# Altium schematic sheet 22_Nvidia_CAN.SchDoc
size A4; SheetNumber: 23; SheetTotal: 24
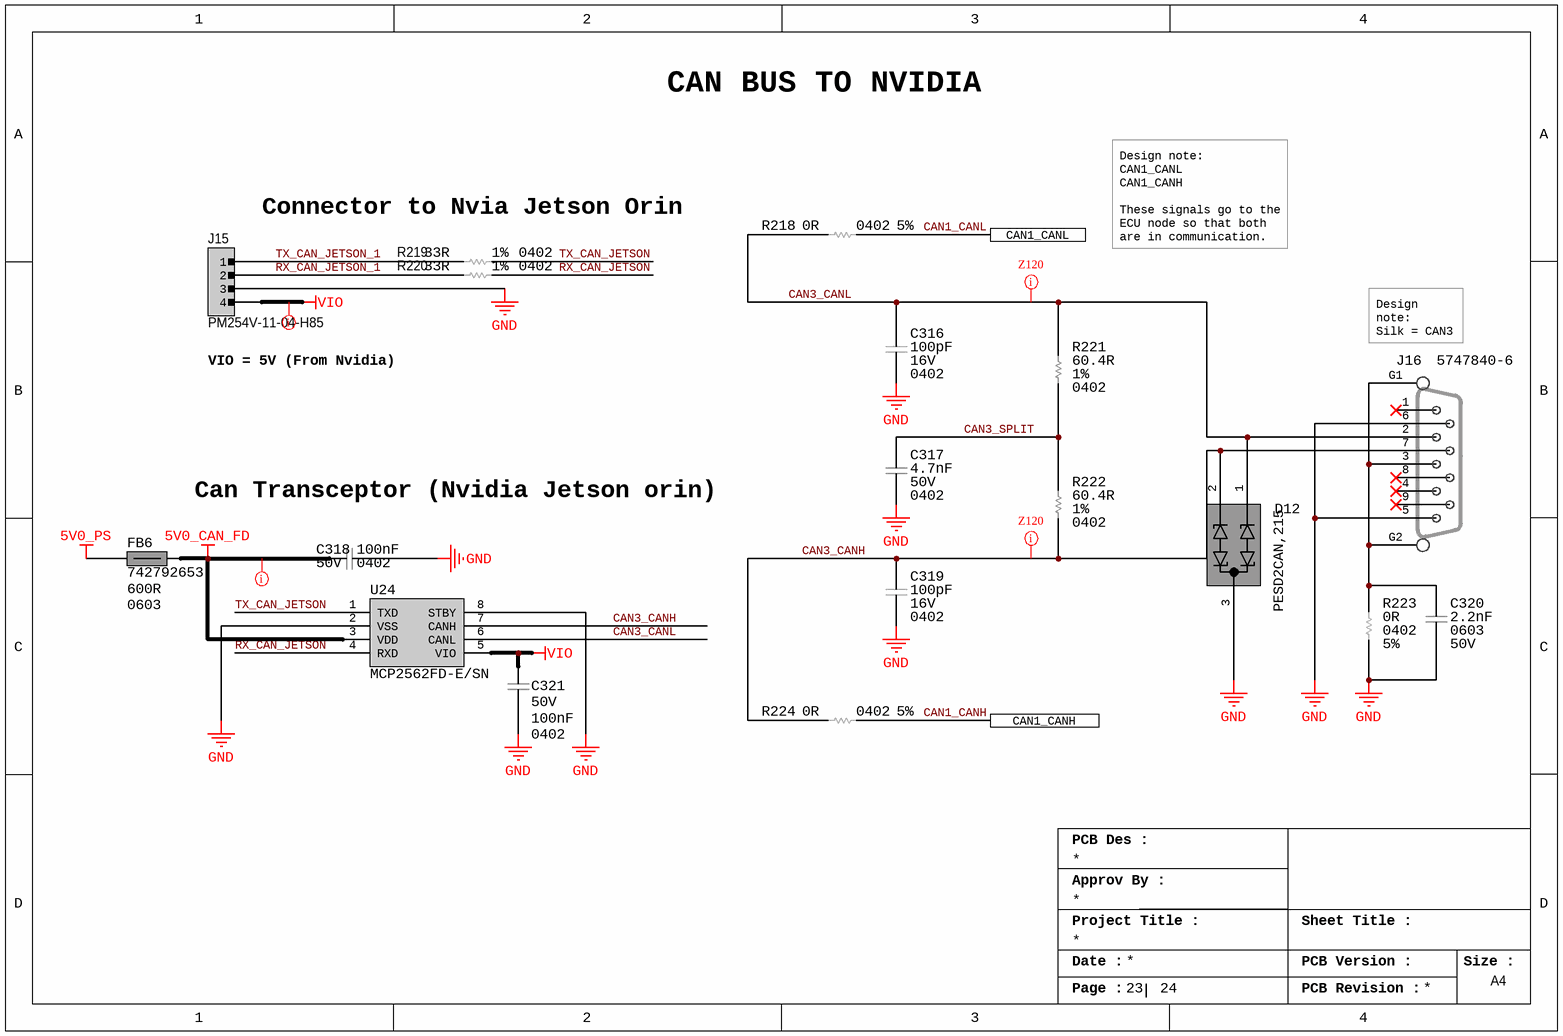
[diagram p0: 22_Nvidia_CAN.SchDoc]

## Parts
C316  Voltage Rating (DC): 16V  Capacitance: 100pF  Case/Package: 0402  [CAP_0402_CAPC1005X05N]  (hidden comment: CC0402JRNPO7BN101)
C317  Voltage Rating: 50V  Capacitance: 4.7nF  Case/Package: 0402  [CAP_0402_CAPC1005X05N]  (hidden comment: GRM155R61H472KA01D)
C318  Voltage Rating: 50V  Capacitance: 100nF  Case/Package: 0402  [CAP_0402_CAPC1005X05N]  (hidden comment: GRM155R71H104KE14D)
C319  Voltage Rating (DC): 16V  Capacitance: 100pF  Case/Package: 0402  [CAP_0402_CAPC1005X05N]  (hidden comment: CC0402JRNPO7BN101)
C320  Case/Package: 0603  Voltage Rating: 50V  Capacitance: 2.2nF  [CAP_0603_CAPC1608X08N]  (hidden comment: GRM1885C1H222JA01D)
C321  Voltage Rating: 50V  Capacitance: 100nF  Case/Package: 0402  [CAP_0402_CAPC1005X05N]  (hidden comment: GRM155R71H104KE14D)
D12  PESD2CAN,215  [DIO_PESD2CAN,215]
FB6  742792653  Impedance: 600R  Case Code (Imperial): 0603  [IND_0603_INDC1608X08N]
J15  PM254V-11-04-H85  [CONN_HEADER_FEM_4P]
J16  5747840-6  [TE_5747840-6]
R218  Case Code (Imperial): 0402  Tolerance: 5%  Resistance: 0R  [RES_0402_RESC1005X04N]  (hidden comment: ERJ-2GE0R00X)
R219  Tolerance: 1%  Resistance: 33R  Case/Package: 0402  [RES_0402_RESC1005X04N]  (hidden comment: RC0402FR-0733RL)
R220  Tolerance: 1%  Resistance: 33R  Case/Package: 0402  [RES_0402_RESC1005X04N]  (hidden comment: RC0402FR-0733RL)
R221  Tolerance: 1%  Resistance: 60.4R  Case/Package: 0402  [RES_0402_RESC1005X04N]  (hidden comment: RK73H1ETTP60R4F)
R222  Tolerance: 1%  Resistance: 60.4R  Case/Package: 0402  [RES_0402_RESC1005X04N]  (hidden comment: RK73H1ETTP60R4F)
R223  Case Code (Imperial): 0402  Tolerance: 5%  Resistance: 0R  [RES_0402_RESC1005X04N]  (hidden comment: ERJ-2GE0R00X)
R224  Case Code (Imperial): 0402  Tolerance: 5%  Resistance: 0R  [RES_0402_RESC1005X04N]  (hidden comment: ERJ-2GE0R00X)
U24  MCP2562FD-E/SN  [SOIC127P600X175-8N]

## Ports
CAN1_CANH, CAN1_CANL

## Nets
5V0_CAN_FD: C318.1 FB6.2 U24.3(VDD)
5V0_PS: FB6.1
GND: C316.1 C317.1 C318.2 C319.1 C320.1 C321.2 D12.3(CC) J15.3 J16.5 J16.6 R223.1 U24.2(VSS) U24.8(STBY)
VIO: C321.1 J15.4 U24.5(VIO)
CAN1_CANH: R224.2 ; port CAN1_CANH
CAN1_CANL: R218.2 ; port CAN1_CANL
CAN3_CANH: C319.2 D12.2(C2) J16.7 R222.1 R224.1 U24.7(CANH)
CAN3_CANL: C316.2 D12.1(C1) J16.2 R218.1 R221.2 U24.6(CANL)
CAN3_SPLIT: C317.2 R221.1 R222.2
RX_CAN_JETSON: R220.2 U24.4(RXD)
RX_CAN_JETSON_1: J15.2 R220.1
TX_CAN_JETSON: R219.2 U24.1(TXD)
TX_CAN_JETSON_1: J15.1 R219.1
NetC320_2: C320.2 J16.3 J16.G1 J16.G2(G) R223.2

Not connected (* = marked no-connect by the designer): J16 1* 4* 8* 9*

## Layout directives
net class PWR: 5V0_CAN_FD, VIO
net class Z120: CAN3_CANH, CAN3_CANL

## Notes on the sheet
- CAN BUS TO NVIDIA
- Connector to Nvia Jetson Orin
- Design note:
  CAN1_CANL
  CAN1_CANH
  These signals go to the ECU node so that both are in communication.
- (near J15) VIO = 5V (From Nvidia)
- (near J16) Design note:
  Silk = CAN3
- Can Transceptor (Nvidia Jetson orin)
- PCB Des :
- Approv By :
- Project Title :
- Sheet Title :
- Date :
- PCB Version :
- Size :
- A4
- Page :
- PCB Revision :

## Library data of the parts
C316 C319 = CAP_100PF_16V_NP0_0402: 0402 100 pF 16 V ±5 % Tolerance NP0 SMT Multilayer Ceramic Capacitor; Manufacturer: Yageo; Tolerance: 5%; Supplier 1: Digi-Key; Manufacturer Part Number: CC0402JRNPO7BN101; RoHS: Yes; Category: Ceramic Capacitors; Stock 1: 66004; Pricing 1: 1=0.1, 10=0.024, 50=0.013, 100=0.0107, 500=0.00764, 1000=0.006, 2500=0.00546, 5000=0.00502 (USD); Mount: Surface Mount; Number of Pins: 2; Case Code (Imperial): 0402; Case Code (Metric): 1005; Weight: 2.3E-05oz; Min Operating Temperature: -55°C; Max Operating Temperature: 125°C; Packaging: Tape and Reel; Voltage Rating: 16V; Dielectric: NP0; Termination: SMD/SMT; Series: CC; Length: 0.039inch; Width: 0.02inch; Thickness: 0.022inch; Lead Free: Lead Free; RoHS Compliant: Yes; ComponentLink1URL: http://www.mouser.com/ds/2/447/Yageo_UPY-GP_NP0_16V-to-50V_9-358835.pdf?src-supplier=Mouser; ComponentLink1Description: http://www.mouser.com/ds/2/447/Yageo_UPY-GP_NP0_16V-to-50V_9-358835.pdf?src-supplier=Mouser; ComponentLink2URL: https://datasheet.octopart.com/CC0402JRNPO7BN101-Yageo-datasheet-137700082.pdf?src-supplier=Future+Electronics; ComponentLink2Description: https://datasheet.octopart.com/CC0402JRNPO7BN101-Yageo-datasheet-137700082.pdf?src-supplier=Future+Electronics; ComponentLink3URL: http://www.yageo.com/documents/recent/UPY-GP_NP0_16V-to-50V_9.pdf?src-supplier=Future+Electronics; ComponentLink3Description: http://www.yageo.com/documents/recent/UPY-GP_NP0_16V-to-50V_9.pdf?src-supplier=Future+Electronics; ComponentLink4URL: http://www.yageo.com/exep/pages/download/literatures/ProductSelectionGuide%202014_Final_2.pdf?src-supplier=Digi-Key; ComponentLink4Description: http://www.yageo.com/exep/pages/download/literatures/ProductSelectionGuide%202014_Final_2.pdf?src-supplier=Digi-Key; ComponentLink5URL: https://www.yageo.com/upload/media/product/productsearch/datasheet/mlcc/UPY-GP_NP0_16V-to-50V_18.pdf?src-supplier=Digi-Key; ComponentLink5Description: https://www.yageo.com/upload/media/product/productsearch/datasheet/mlcc/UPY-GP_NP0_16V-to-50V_18.pdf?src-supplier=Digi-Key; ComponentLink6URL: http://www.yageo.com/documents/recent/UPY-GP_NP0_16V-to-50V_16.pdf?src-supplier=Digi-Key; ComponentLink6Description: http://www.yageo.com/documents/recent/UPY-GP_NP0_16V-to-50V_16.pdf?src-supplier=Digi-Key; ComponentLink7URL: https://datasheet.octopart.com/CC0402JRNPO7BN101-Yageo-datasheet-65873193.pdf?src-supplier=Farnell; ComponentLink7Description: https://datasheet.octopart.com/CC0402JRNPO7BN101-Yageo-datasheet-65873193.pdf?src-supplier=Farnell; Supplier Part Number 1: 311-3743-1-ND
C317 = CAP_4700PF_50V_X5R_0402: Multilayer Ceramic Capacitor, 100 uF, 16 V, ± 20%, X5R, 1210 [3225 Metric]; Manufacturer: Murata; Tolerance: 10%; Material: 4241ConductorMaterial; Supplier 1: Digikey; Manufacturer Part Number: GRM155R61H472KA01D; RoHS: Yes; Category: Ceramic Capacitors; Stock 1: 61974; Pricing 1: 1=0.1, 10=0.029, 50=0.0166, 100=0.0129, 500=0.00974, 1000=0.00765, 2500=0.00695, 5000=0.0064 (USD); Mount: Surface Mount; Case Code (Metric): 1005; Case Code (Imperial): 0402; Min Operating Temperature: -55°C; Max Operating Temperature: 85°C; Packaging: Tape and Reel; Package Quantity: 10000; Voltage Rating (DC): 50V; Dielectric: X5R; Termination: SMD/SMT; Series: GRM; Construction: Flat; Length: 1mm; Width: 0.02inch; Height: 0.5mm; Thickness: 0.022inch; Depth: 0.5mm; Radiation Hardening: No; RoHS Compliant: Yes; ComponentLink1URL: https://datasheet.ciiva.com/6263/product-6263668.pdf?src-supplier=Digikey; ComponentLink1Description: https://datasheet.ciiva.com/6263/product-6263668.pdf?src-supplier=Digikey; ComponentLink2URL: https://datasheet.ciiva.com/6263/partnumbering-e-01-6263670.pdf?src-supplier=Digikey; ComponentLink2Description: https://datasheet.ciiva.com/6263/partnumbering-e-01-6263670.pdf?src-supplier=Digikey; ComponentLink3URL: https://datasheet.ciiva.com/11620/product-11620407.pdf?src-supplier=Avnet; ComponentLink3Description: https://datasheet.ciiva.com/11620/product-11620407.pdf?src-supplier=Avnet; ComponentLink4URL: https://datasheet.ciiva.com/6263/partnumbering-e-01-6263672.pdf?src-supplier=Digikey; ComponentLink4Description: https://datasheet.ciiva.com/6263/partnumbering-e-01-6263672.pdf?src-supplier=Digikey; Supplier Part Number 1: 490-6317-1-ND; Supplier 2: Digikey; Stock 2: 503358; Pricing 2: 1=1.73, 10=1.295, 50=1.1816, 100=0.9681 (USD); Reach SVHC Compliant: No; ComponentLink5URL: http://www.farnell.com/datasheets/1497285.pdf?src-supplier=Farnell; ComponentLink5Description: http://www.farnell.com/datasheets/1497285.pdf?src-supplier=Farnell; Supplier Part Number 2: 587-3152-1-ND
C318 C321 = CAP_100NF_50V_X7R_0402: Multilayer Ceramic Capacitor, 0.1 uF, 16 V, ± 10%, X7R, 0402 [1005 Metric]; Manufacturer: Murata; Dissipation Factor: 0.025%; Temperature Coefficient: 30ppm/°C; Supplier 1: DigiKey; Manufacturer Part Number: GRM155R71H104KE14D; RoHS: Yes; Category: Ceramic Capacitors; Stock 1: 13730790; Pricing 1: 1=0.1, 10=0.023, 50=0.0132, 100=0.0102, 500=0.00768, 1000=0.00603, 2500=0.00548, 5000=0.00504 (USD); Mount: Surface Mount; Number of Pins: 2NUMBER; Case Code (Metric): 1005; Material: Ceramic; Case Code (Imperial): 0402; Weight: 0.000212oz; Dielectric Material: Ceramic; Min Operating Temperature: -55°C; Max Operating Temperature: 125°C; Packaging: Tape and Reel; Package Quantity: 10000; Series: GRM; Tolerance: 10%; Dielectric: X7R; Termination: SMD/SMT; Voltage: 50V; Voltage Rating (DC): 50V; Construction: Flat; Length: 1mm; Width: 0.5mm; Height: 0.5mm; Depth: 0.5mm; Thickness: 0.022inch; Reach SVHC Compliant: No; RoHS Compliant: Yes; Lead Free: 5697LeadFree; ComponentLink1URL: http://www.farnell.com/datasheets/2079156.pdf?src-supplier=Farnell; ComponentLink1Description: http://www.farnell.com/datasheets/2079156.pdf?src-supplier=Farnell; ComponentLink2URL: http://www.mouser.com/ds/2/281/c02e-2905.pdf?src-supplier=Mouser; ComponentLink2Description: http://www.mouser.com/ds/2/281/c02e-2905.pdf?src-supplier=Mouser; ComponentLink3URL: http://www.farnell.com/datasheets/2079156.pdf?src-supplier=Newark; ComponentLink3Description: http://www.farnell.com/datasheets/2079156.pdf?src-supplier=Newark; ComponentLink4URL: https://datasheet.octopart.com/GRM155R71H104KE14D-Murata-datasheet-22122223.pdf?src-supplier=Future+Electronics; ComponentLink4Description: https://datasheet.octopart.com/GRM155R71H104KE14D-Murata-datasheet-22122223.pdf?src-supplier=Future+Electronics; ComponentLink5URL: https://search.murata.co.jp/Ceramy/image/img/A01X/G101/ENG/GRM155R71H104KE14-01.pdf?src-supplier=Digi-Key; ComponentLink5Description: https://search.murata.co.jp/Ceramy/image/img/A01X/G101/ENG/GRM155R71H104KE14-01.pdf?src-supplier=Digi-Key; ComponentLink6URL: http://psearch.en.murata.com/capacitor/product/GRM155R71H104KE14%23.pdf?src-supplier=Avnet; ComponentLink6Description: http://psearch.en.murata.com/capacitor/product/GRM155R71H104KE14%23.pdf?src-supplier=Avnet; ComponentLink7URL: https://datasheet.octopart.com/GRM155R71H104KE14D-Murata-datasheet-66077078.pdf?src-supplier=Element14; ComponentLink7Description: https://datasheet.octopart.com/GRM155R71H104KE14D-Murata-datasheet-66077078.pdf?src-supplier=Element14; Supplier Part Number 1: 490-10700-6-ND; Supplier 2: Digikey; Stock 2: 3706055; Pricing 2: 1=0.1, 10=0.037, 50=0.021, 100=0.0162, 500=0.01224, 1000=0.00961, 2500=0.00874, 5000=0.00804 (USD); Halogen Free: 5694HalogenFree; ComponentLink8URL: http://www.mouser.com/ds/2/447/UPY-GPHC_X5R_4V-to-50V_25-1131599.pdf?src-supplier=Mouser; ComponentLink8Description: http://www.mouser.com/ds/2/447/UPY-GPHC_X5R_4V-to-50V_25-1131599.pdf?src-supplier=Mouser; ComponentLink9URL: https://datasheet.octopart.com/CC0402KRX5R8BB104-Yageo-datasheet-137700082.pdf?src-supplier=Future+Electronics; ComponentLink9Description: https://datasheet.octopart.com/CC0402KRX5R8BB104-Yageo-datasheet-137700082.pdf?src-supplier=Future+Electronics; ComponentLink10URL: http://www.yageo.com/documents/recent/UPY-GPHC_X5R_4V-to-50V_25.pdf?src-supplier=Digikey; ComponentLink10Description: http://www.yageo.com/documents/recent/UPY-GPHC_X5R_4V-to-50V_25.pdf?src-supplier=Digikey; ComponentLink11URL: https://datasheet.octopart.com/CC0402KRX5R8BB104-Yageo-datasheet-140260304.pdf?src-supplier=Newark; ComponentLink11Description: https://datasheet.octopart.com/CC0402KRX5R8BB104-Yageo-datasheet-140260304.pdf?src-supplier=Newark; ComponentLink12URL: https://datasheet.octopart.com/CC0402KRX5R8BB104-Yageo-datasheet-170350636.pdf?src-supplier=Future+Electronics; ComponentLink12Description: https://datasheet.octopart.com/CC0402KRX5R8BB104-Yageo-datasheet-170350636.pdf?src-supplier=Future+Electronics; ComponentLink13URL: http://www.yageo.com/documents/recent/UPY-GPHC_X5R_4V-to-50V-16.pdf?src-supplier=Future+Electronics; ComponentLink13Description: http://www.yageo.com/documents/recent/UPY-GPHC_X5R_4V-to-50V-16.pdf?src-supplier=Future+Electronics; Supplier Part Number 2: 311-1697-1-ND
C320 = CAP_2.2nF_50V_NP0_0402: Multilayer Ceramic Capacitor, 2200 pF, 50 V, ï¿½ 5%, C0G (NP0), 0603 [1608 Metric]; Manufacturer: Murata; Insulation Resistance: 10GR; Temperature Coefficient: 30ppm/°C; Supplier 1: Digikey; Manufacturer Part Number: GRM1885C1H222JA01D; RoHS: Yes; Category: Ceramic Capacitors; Stock 1: 228613; Pricing 1: 1=0.1, 10=0.045, 50=0.0306, 100=0.0262, 500=0.01882, 1000=0.01654 (USD); Mount: Surface Mount; Number of Pins: 2; Case Code (Imperial): 0603; Case Code (Metric): 1608; Material: Ceramic; Dielectric Material: Ceramic; Min Operating Temperature: -55°C; Max Operating Temperature: 125°C; Tolerance: 5%; Packaging: Tape and Reel; Voltage Rating (DC): 50V; Package Quantity: 1; Dielectric: C0G; Termination: SMD/SMT; Voltage: 50V; Series: GRM; Construction: Flat; Length: 1.6mm; Width: 0.031inch; Height: 0.8mm; Thickness: 0.035inch; Depth: 0.8mm; Reach SVHC Compliant: No; Lead Free: Lead Free; RoHS Compliant: Yes; ComponentLink1URL: https://datasheet.ciiva.com/3777/1632grm1885c1h222ja0123-3777835.pdf?src-supplier=Arrow+Electronics; ComponentLink1Description: https://datasheet.ciiva.com/3777/1632grm1885c1h222ja0123-3777835.pdf?src-supplier=Arrow+Electronics; ComponentLink2URL: https://datasheet.ciiva.com/11786/0900766b807a1cab-11786840.pdf?src-supplier=Rs; ComponentLink2Description: https://datasheet.ciiva.com/11786/0900766b807a1cab-11786840.pdf?src-supplier=Rs; ComponentLink3URL: https://datasheet.ciiva.com/133/partnumbering-e-01-133576.pdf?src-supplier=Digikey; ComponentLink3Description: https://datasheet.ciiva.com/133/partnumbering-e-01-133576.pdf?src-supplier=Digikey; ComponentLink4URL: https://datasheet.ciiva.com/133/partnumbering-e-01-133577.pdf?src-supplier=Digikey; ComponentLink4Description: https://datasheet.ciiva.com/133/partnumbering-e-01-133577.pdf?src-supplier=Digikey; ComponentLink5URL: https://datasheet.ciiva.com/133/partnumbering-e-01-133578.pdf?src-supplier=Digikey; ComponentLink5Description: https://datasheet.ciiva.com/133/partnumbering-e-01-133578.pdf?src-supplier=Digikey; ComponentLink6URL: https://datasheet.ciiva.com/11463/product-11463974.pdf?src-supplier=Avnet; ComponentLink6Description: https://datasheet.ciiva.com/11463/product-11463974.pdf?src-supplier=Avnet; ComponentLink7URL: https://datasheet.ciiva.com/2989/product-2989459.pdf?src-supplier=Avnet; ComponentLink7Description: https://datasheet.ciiva.com/2989/product-2989459.pdf?src-supplier=Avnet; ComponentLink8URL: https://datasheet.ciiva.com/6031/4360-6031797.pdf?src-supplier=Farnell; ComponentLink8Description: https://datasheet.ciiva.com/6031/4360-6031797.pdf?src-supplier=Farnell; ComponentLink9URL: https://datasheet.ciiva.com/7828/4360-7828918.pdf?src-supplier=Element14; ComponentLink9Description: https://datasheet.ciiva.com/7828/4360-7828918.pdf?src-supplier=Element14; ComponentLink10URL: https://datasheet.ciiva.com/7828/1747455-7828919.pdf?src-supplier=Element14; ComponentLink10Description: https://datasheet.ciiva.com/7828/1747455-7828919.pdf?src-supplier=Element14; ComponentLink11URL: https://datasheet.ciiva.com/7828/1747455-7828920.pdf?src-supplier=Element14; ComponentLink11Description: https://datasheet.ciiva.com/7828/1747455-7828920.pdf?src-supplier=Element14; Supplier Part Number 1: 490-1459-1-ND
D12 = DIO_TVS_41V_5A_PESD2CAN,215: 5A 230W 41V 26.2V Bidirectional 24V SOT-23 ESD and Surge Protection (TVS/ESD) ROHS; Manufacturer: Nexperia; Breakdown Voltage: 30.3V; Number of Channels: 1NUMBER; Supplier 1: Digikey; Manufacturer Part Number: PESD2CAN,215; RoHS: No; Category: TVS Diodes; Stock 1: 144616; Pricing 1: 1=0.37, 10=0.246, 100=0.187, 500=0.148, 1000=0.128, 3000=0.10404 (USD); Number of Pins: 3NUMBER; Direction: Bidirectional; Clamping Voltage: 41V; Peak Pulse Current: 5A; Reverse Standoff Voltage: 24V; Operating Supply Voltage: 24V; Height: 1.1mm; ComponentLink1URL: http://www.farnell.com/datasheets/1750978.pdf?src-supplier=Farnell; ComponentLink1Description: http://www.farnell.com/datasheets/1750978.pdf?src-supplier=Farnell; ComponentLink2URL: https://assets.nexperia.com/documents/data-sheet/PESD2CAN.pdf?src-supplier=Digikey; ComponentLink2Description: https://assets.nexperia.com/documents/data-sheet/PESD2CAN.pdf?src-supplier=Digikey; ComponentLink3URL: http://www.farnell.com/datasheets/1750978.pdf?src-supplier=Newark; ComponentLink3Description: http://www.farnell.com/datasheets/1750978.pdf?src-supplier=Newark; Supplier Part Number 1: 1727-3891-1-ND
FB6 = IND_FERRITE_BEADS_600R_300mA_0603_742792653: WE-CBF Ferrite Bead 0603 600Ohm 300mA | Wurth Elektronik 742792653; Manufacturer: Wurth Electronics; Tolerance: 25%; Number of Lines: 1; Inductance: 2.4nH; Test Frequency: 200MHz; Supplier 1: Digikey; Manufacturer Part Number: 742792653; RoHS: Yes; Category: Ferrite Beads and Chips; Stock 1: 14278; Pricing 1: 1=0.16, 50=0.1612, 100=0.1485, 500=0.1422, 1000=0.135, 2000=0.1287 (USD); Mount: Surface Mount; Case/Package: SMD/SMT; Core Material: Ferrite; Case Code (Metric): 1608; Weight: 7.1E-05oz; Material: Ferrite; Min Operating Temperature: -55°C; Max Operating Temperature: 125°C; Packaging: Tape and Reel; Package Quantity: 1; Max Current Rating: 300mA; Max DC Current: 300mA; Termination: SMD/SMT; Series: WE-CBF; Length: 1.6mm; Width: 0.8mm; Height: 0.8mm; Depth: 0.8mm; Lead Free: Lead Free; RoHS Compliant: Yes; Reach SVHC Compliant: Unknown; ComponentLink1URL: https://datasheet.ciiva.com/29364/742792653-29364337.pdf?src-supplier=Digikey; ComponentLink1Description: https://datasheet.ciiva.com/29364/742792653-29364337.pdf?src-supplier=Digikey; ComponentLink2URL: https://datasheet.ciiva.com/1475/1696030-1475350.pdf?src-supplier=Farnell; ComponentLink2Description: https://datasheet.ciiva.com/1475/1696030-1475350.pdf?src-supplier=Farnell; ComponentLink3URL: https://datasheet.ciiva.com/11799/0900766b80d2e07a-11799236.pdf?src-supplier=Rs; ComponentLink3Description: https://datasheet.ciiva.com/11799/0900766b80d2e07a-11799236.pdf?src-supplier=Rs; ComponentLink4URL: https://datasheet.ciiva.com/1466/1696030-1466507.pdf?src-supplier=Element14; ComponentLink4Description: https://datasheet.ciiva.com/1466/1696030-1466507.pdf?src-supplier=Element14; ComponentLink5URL: https://datasheet.ciiva.com/14122/742792653-eng-tds-14122813.pdf?src-supplier=Distrelec; ComponentLink5Description: https://datasheet.ciiva.com/14122/742792653-eng-tds-14122813.pdf?src-supplier=Distrelec; Supplier Part Number 1: 732-4668-1-ND; Current Rating: 300mA
J15 = CONN_HEADER_FEMALE_4P_2.54mm_JLCPCB: 2.54mm Plugin 4P Brass Straight 1x4P Plugin,P=2.54mm  Female Headers ROHS; Manufacturer: XFCN; Number of Positions: 4; Connector Type: Header; Voltage Rating: 250V; Supplier: Jlcpcb; Manufacturer Part Number: PM254V-11-04-H85; RoHS: Yes; Category: Connectors; Mount: Through Hole; Contact Material: Bronze; Housing Material: Plastic; Contact Finish - Mating: TIN; Insulation Color: Black; Insulation Material: Polyester; Contact Shape: Square; Min Operating Temperature: -40°C; Max Operating Temperature: 105°C; Number of Rows: 1; Packaging: Tray; Termination: Solder; Contact Type: Female Socket; Fastening Type: Pull; Series: -; Length: 10.7mm; Width: 2.5mm; Height: 8.5mm; Pitch: 2.54mm; Lead Free: Lead Free; RoHS Compliant: Yes; Flammability Rating: UL94 V-0; JLCPCB Part Number: C541851
J16 = CONN_DB9_TEConnectivity_5747840-6: D Subminiature Connector, 9 Contact(s), Male, 0.108 inch Pitch, Solder Terminal, #4-40, Plug; Gender: 29Gender; Number of Positions: 9NUMBER; Voltage Rating: 125V; Mating Connector Lock: 5962ProductFeature; PCB Mount Retention: 5953PCBMountRetention; Sealable: 5964ProductFeature; Current Rating: 6A; Circuit Application: 5778ConnectorType; Row Spacing: 2.8448mm; Supplier 1: Digikey; Manufacturer: TE Connectivity; Manufacturer Part Number: 5747840-6; RoHS: Yes; Category: D-Sub Connectors; Stock 1: 5638; Pricing 1: 1=4.92, 10=4.183, 25=3.9212, 50=3.7338, 130=3.49023, 260=3.32365, 520=3.1651, 1040=3.01412, 2600=2.82563 (USD); Mount: 9Mount; Number of Pins: 9NUMBER; Contact Material: 152ConductorMaterial; Contact Plating: 154,157ConductorMaterial; Material: 155ConductorMaterial; Contact Shape: 4456Shape; Housing Color: 46Colour; Housing Material: 4261ConductorMaterial; Color: 46Colour; Min Operating Temperature: -55°C; Max Operating Temperature: 105°C; Orientation: 5492OrientationType; Number of Contacts: 9NUMBER; Number of Rows: 2NUMBER; Height: 12.93mm; Lead Free: 5697LeadFree; ComponentLink1URL: https://datasheet.octopart.com/5747840-6-Tyco-Electronics-datasheet-5319747.pdf?src-supplier=Farnell; ComponentLink1Description: https://datasheet.octopart.com/5747840-6-Tyco-Electronics-datasheet-5319747.pdf?src-supplier=Farnell; ComponentLink2URL: https://datasheet.octopart.com/5747840-6-TE-Connectivity---AMP-datasheet-65569592.pdf?src-supplier=Newark; ComponentLink2Description: https://datasheet.octopart.com/5747840-6-TE-Connectivity---AMP-datasheet-65569592.pdf?src-supplier=Newark; ComponentLink3URL: https://datasheet.octopart.com/5747840-6-Tyco-Electronics-datasheet-11086102.pdf?src-supplier=Verical; ComponentLink3Description: https://datasheet.octopart.com/5747840-6-Tyco-Electronics-datasheet-11086102.pdf?src-supplier=Verical; ComponentLink4URL: https://datasheet.octopart.com/5747840-6-Tyco-Electronics-datasheet-5315872.pdf?src-supplier=Electro+Sonic; ComponentLink4Description: https://datasheet.octopart.com/5747840-6-Tyco-Electronics-datasheet-5315872.pdf?src-supplier=Electro+Sonic; Supplier Part Number 1: A32094-ND
R218 R223 R224 = RES_0R_5%_100mW_0402: SMD Chip Resistor, Jumper, 0 ohm, 100 mW, 0402 [1005 Metric], Thick Film, General Purpose; Manufacturer: Panasonic; Power Rating: 100mW; Voltage Rating: 50V; Temperature Coefficient: 600ppm/°C; Supplier 1: Mouser; Manufacturer Part Number: ERJ-2GE0R00X; RoHS: Yes; Category: Chip SMD Resistors; Stock 1: 10989354; Pricing 1: 1=0.1, 10=0.013, 50=0.013, 100=0.006, 1000=0.004, 2500=0.003, 10000=0.003 (USD); Mount: Surface Mount; Case/Package: 0402; Contact Plating: Tin; Case Code (Metric): 1005; Size Code: 0402; Min Operating Temperature: -55°C; Max Operating Temperature: 155°C; Resistor Type: Thick Film; Packaging: Cut Tape; Package Quantity: 10000; Number of Terminations: 2; Termination: SMD/SMT; Max Power Dissipation: 100mW; Voltage Rating (DC): 50V; Features: Automotive AEC-Q200; Series: ERJ; Construction: Rectangular; Technology: THICK FILM; Length: 1mm; Width: 0.5mm; Height: 0.35mm; Depth: 0.5mm; Ratings: AEC-Q200; Radiation Hardening: No; Reach SVHC Compliant: No; Military Standard: Not; Lead Free: Lead Free; RoHS Compliant: Yes; ComponentLink1URL: https://datasheet.ciiva.com/11821/0900766b80f806dd-11821176.pdf?src-supplier=Rs; ComponentLink1Description: https://datasheet.ciiva.com/11821/0900766b80f806dd-11821176.pdf?src-supplier=Rs; ComponentLink2URL: https://datasheet.ciiva.com/43460/1678796-43460347.pdf?src-supplier=Farnell; ComponentLink2Description: https://datasheet.ciiva.com/43460/1678796-43460347.pdf?src-supplier=Farnell; ComponentLink3URL: https://datasheet.ciiva.com/46389/1678796-46389518.pdf?src-supplier=Element14; ComponentLink3Description: https://datasheet.ciiva.com/46389/1678796-46389518.pdf?src-supplier=Element14; ComponentLink4URL: https://datasheet.ciiva.com/5959/1678796-5959692.pdf?src-supplier=Farnell; ComponentLink4Description: https://datasheet.ciiva.com/5959/1678796-5959692.pdf?src-supplier=Farnell; ComponentLink5URL: https://datasheet.ciiva.com/28695/1678796-28695758.pdf?src-supplier=Element14; ComponentLink5Description: https://datasheet.ciiva.com/28695/1678796-28695758.pdf?src-supplier=Element14; ComponentLink6URL: https://datasheet.ciiva.com/16783/70260739-16783734.pdf?src-supplier=Allied+Electronics; ComponentLink6Description: https://datasheet.ciiva.com/16783/70260739-16783734.pdf?src-supplier=Allied+Electronics; ComponentLink7URL: https://datasheet.ciiva.com/16778/70260739-16778335.pdf?src-supplier=Allied+Electronics; ComponentLink7Description: https://datasheet.ciiva.com/16778/70260739-16778335.pdf?src-supplier=Allied+Electronics; ComponentLink8URL: https://datasheet.ciiva.com/48531/aoa0000ce1-48531077.pdf?src-supplier=Avnet; ComponentLink8Description: https://datasheet.ciiva.com/48531/aoa0000ce1-48531077.pdf?src-supplier=Avnet; ComponentLink9URL: https://datasheet.ciiva.com/30097/4aoa0000ce1-30097116.pdf?src-supplier=Onlinecomponents.com; ComponentLink9Description: https://datasheet.ciiva.com/30097/4aoa0000ce1-30097116.pdf?src-supplier=Onlinecomponents.com; Supplier Part Number 1: 667-ERJ-2GE0R00X
R219 R220 = RES_33R_1%_62.5mW_0402: SMD Chip Resistor, 33 Ohm, ± 1%, 62.5 mW, 0402 [1005 Metric], Thick Film, General Purpose; Manufacturer: Yageo; Power Rating: 62.5mW; Voltage Rating: 50V; Temperature Coefficient: 100ppm/°C; Max Power Dissipation: 63mW; Supplier 1: Digikey; Manufacturer Part Number: RC0402FR-0733RL; RoHS: Yes; Category: Chip SMD Resistors; Stock 1: 4637808; Pricing 1: 1=0.1, 10=0.015, 50=0.0088, 100=0.0073, 500=0.00488, 1000=0.00417, 5000=0.00297, 10000=0.00261, 20000=0.00231, 30000=0.00216, 50000=0.00199, 100000=0.00179 (USD); Number of Pins: 2; Case Code (Imperial): 0402; Case Code (Metric): 1005; Size Code: 0402; Min Operating Temperature: -55°C; Max Operating Temperature: 155°C; Packaging: Tape and Reel; Voltage Rating (DC): 50V; Package Quantity: 10000; Termination: SMD/SMT; Resistor Type: Thick Film; Features: Moisture Resistant; Series: RC; Number of Terminations: 2; Resistance Tolerance: 1%; Construction: Rectangular; Technology: THICK FILM; Voltage Rating (AC): 50V; Length: 1mm; Width: 0.5mm; Height: 0.35mm; Depth: 0.5mm; Military Standard: Not; Lead Free: Lead Free; RoHS Compliant: Yes; Reach SVHC Compliant: Unknown; ComponentLink1URL: https://datasheet.ciiva.com/11819/0900766b80c66297-11819487.pdf?src-supplier=Rs; ComponentLink1Description: https://datasheet.ciiva.com/11819/0900766b80c66297-11819487.pdf?src-supplier=Rs; ComponentLink2URL: https://datasheet.ciiva.com/7849/1018594-7849966.pdf?src-supplier=Element14; ComponentLink2Description: https://datasheet.ciiva.com/7849/1018594-7849966.pdf?src-supplier=Element14; ComponentLink3URL: https://datasheet.ciiva.com/7849/1018594-7849967.pdf?src-supplier=Element14; ComponentLink3Description: https://datasheet.ciiva.com/7849/1018594-7849967.pdf?src-supplier=Element14; ComponentLink4URL: https://datasheet.ciiva.com/24070/pyu-rc0402-51-rohs-l-6-r-8721-24070077.pdf?src-supplier=Mouser; ComponentLink4Description: https://datasheet.ciiva.com/24070/pyu-rc0402-51-rohs-l-6-r-8721-24070077.pdf?src-supplier=Mouser; Supplier Part Number 1: 311-33.0LRCT-ND
R221 R222 = RES_60.4R_1%_100mW_0402: Res Thick Film 0402 60.4 Ohm 1% 0.1W(1/10W) ±100ppm/C Pad SMD Automotive T/R; Manufacturer: KOA Speer; Power Rating: 63mW; Voltage Rating: 50V; Temperature Coefficient: 100ppm/°C; Max Power Dissipation: 100mW; Supplier 1: Digikey; Manufacturer Part Number: RK73H1ETTP60R4F; RoHS: Yes; Category: Chip SMD Resistors; Stock 1: 72753; Pricing 1: 1=0.1, 10=0.027, 100=0.0129, 1000=0.00713, 2500=0.00585, 5000=0.00544 (USD); Mount: Surface Mount; Case Code (Imperial): 0402; Case Code (Metric): 1005; Min Operating Temperature: -55°C; Max Operating Temperature: 155°C; Packaging: Tape and Reel; Package Quantity: 10000; Termination: SMD/SMT; Voltage Rating (DC): 50V; Series: RK73H; Construction: Rectangular; Technology: THICK FILM; Features: Moisture Resistant,Automotive AEC-Q200; Number of Terminations: 2; Length: 1mm; Width: 0.5mm; Height: 0.35mm; Depth: 0.5mm; Ratings: AEC-Q200; Military Standard: Not; RoHS Compliant: Yes; ComponentLink1URL: https://datasheet.ciiva.com/5555/rk73h-5555837.pdf?src-supplier=Mouser; ComponentLink1Description: https://datasheet.ciiva.com/5555/rk73h-5555837.pdf?src-supplier=Mouser; Supplier Part Number 1: 2019-RK73H1ETTP60R4FCT-ND
U24 = IC_TRANSCEIVER_CAN_MCP2562FD-E/SN: MCP2562 Series 5 V Surface Mount High-Speed CAN Transceiver - SOIC-8; Manufacturer: Microchip; Number of Receivers: 1; Data Rate: 8Mbps; Min Supply Voltage: 4.5V; Max Supply Voltage: 5.5V; Max Supply Current: 70mA; Propagation Delay: 120ns; Receiver Hysteresis: 200mV; Operating Supply Voltage: 5V; Supplier 1: Digikey; Manufacturer Part Number: MCP2562FD-E/SN; RoHS: Yes; Category: Interface ICs; Stock 1: 36654; Pricing 1: 100=0.98 (USD); Mount: Surface Mount; Case/Package: SOIC; Number of Pins: 8; Weight: 0.019048oz; Min Operating Temperature: -40°C; Max Operating Temperature: 125°C; Packaging: Rail/Tube; Number of Transceivers: 1; Interface: CAN; Number of Drivers: 1; Number of Transmit Buffers: 1; Number of Receive Buffers: 1; Operating Supply Current: 70mA; Package Quantity: 100; Series: -; Length: 4.9mm; Width: 3.9mm; Height: 1.5mm; Reach SVHC Compliant: No; Lead Free: Lead Free; RoHS Compliant: Yes; ComponentLink1URL: https://datasheet.ciiva.com/48473/20005284a-48473180.pdf?src-supplier=Avnet; ComponentLink1Description: https://datasheet.ciiva.com/48473/20005284a-48473180.pdf?src-supplier=Avnet; ComponentLink2URL: https://datasheet.ciiva.com/48512/mcp2562fd-e-mf-eng-tds-48512074.pdf?src-supplier=Distrelec; ComponentLink2Description: https://datasheet.ciiva.com/48512/mcp2562fd-e-mf-eng-tds-48512074.pdf?src-supplier=Distrelec; ComponentLink3URL: https://datasheet.ciiva.com/46406/1821190-46406053.pdf?src-supplier=Element14; ComponentLink3Description: https://datasheet.ciiva.com/46406/1821190-46406053.pdf?src-supplier=Element14; ComponentLink4URL: https://datasheet.ciiva.com/46406/1821190-46406061.pdf?src-supplier=Element14; ComponentLink4Description: https://datasheet.ciiva.com/46406/1821190-46406061.pdf?src-supplier=Element14; Supplier Part Number 1: MCP2562FD-E/SN-ND